# EAGLE design CharlieplexNameTag (EAGLE 6.5.0)
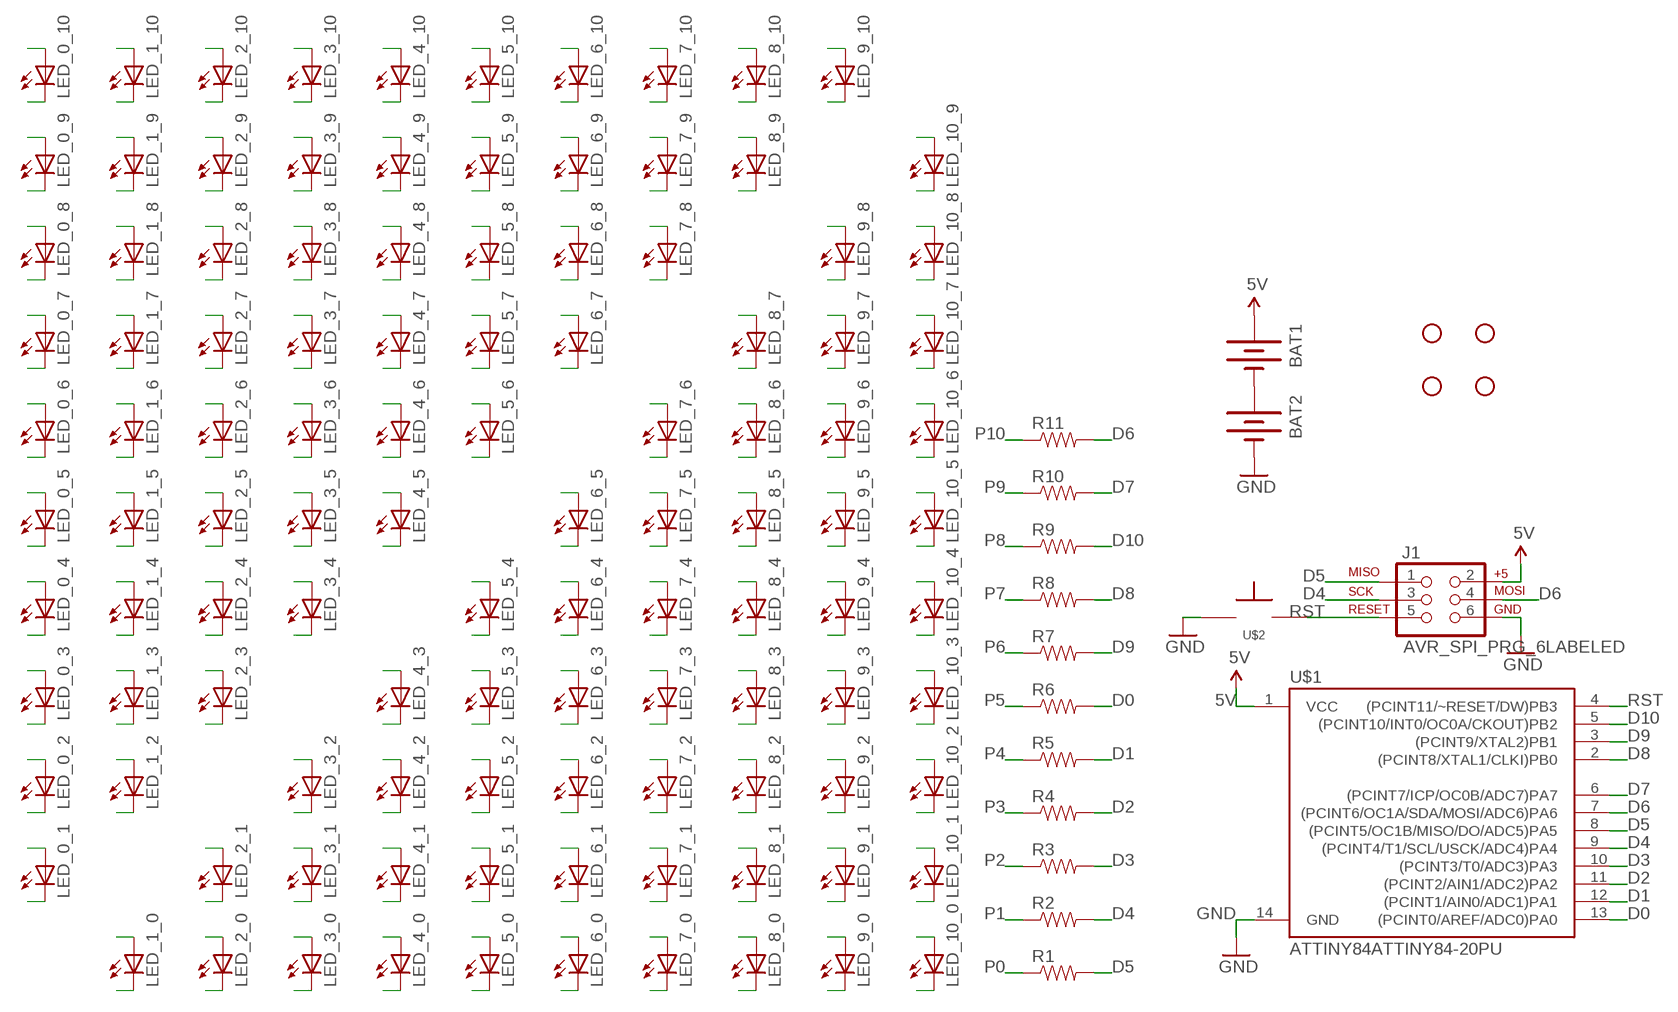
[diagram p0: schematic, sheet 1]

## Parts
BAT1  BATTERYAAA  [BATTERY-AAA]
BAT2  BATTERYAAA  [BATTERY-AAA]
J1  AVR_SPI_PRG_6LABELED  [2X3-NS]
LED_0_1  LED3MM  [LED3MM]
LED_0_2  LED3MM  [LED3MM]
LED_0_3  LED3MM  [LED3MM]
LED_0_4  LED3MM  [LED3MM]
LED_0_5  LED3MM  [LED3MM]
LED_0_6  LED3MM  [LED3MM]
LED_0_7  LED3MM  [LED3MM]
LED_0_8  LED3MM  [LED3MM]
LED_0_9  LED3MM  [LED3MM]
LED_0_10  LED3MM  [LED3MM]
LED_1_0  LED3MM  [LED3MM]
LED_1_2  LED3MM  [LED3MM]
LED_1_3  LED3MM  [LED3MM]
LED_1_4  LED3MM  [LED3MM]
LED_1_5  LED3MM  [LED3MM]
LED_1_6  LED3MM  [LED3MM]
LED_1_7  LED3MM  [LED3MM]
LED_1_8  LED3MM  [LED3MM]
LED_1_9  LED3MM  [LED3MM]
LED_1_10  LED3MM  [LED3MM]
LED_2_0  LED3MM  [LED3MM]
LED_2_1  LED3MM  [LED3MM]
LED_2_3  LED3MM  [LED3MM]
LED_2_4  LED3MM  [LED3MM]
LED_2_5  LED3MM  [LED3MM]
LED_2_6  LED3MM  [LED3MM]
LED_2_7  LED3MM  [LED3MM]
LED_2_8  LED3MM  [LED3MM]
LED_2_9  LED3MM  [LED3MM]
LED_2_10  LED3MM  [LED3MM]
LED_3_0  LED3MM  [LED3MM]
LED_3_1  LED3MM  [LED3MM]
LED_3_2  LED3MM  [LED3MM]
LED_3_4  LED3MM  [LED3MM]
LED_3_5  LED3MM  [LED3MM]
LED_3_6  LED3MM  [LED3MM]
LED_3_7  LED3MM  [LED3MM]
LED_3_8  LED3MM  [LED3MM]
LED_3_9  LED3MM  [LED3MM]
LED_3_10  LED3MM  [LED3MM]
LED_4_0  LED3MM  [LED3MM]
LED_4_1  LED3MM  [LED3MM]
LED_4_2  LED3MM  [LED3MM]
LED_4_3  LED3MM  [LED3MM]
LED_4_5  LED3MM  [LED3MM]
LED_4_6  LED3MM  [LED3MM]
LED_4_7  LED3MM  [LED3MM]
LED_4_8  LED3MM  [LED3MM]
LED_4_9  LED3MM  [LED3MM]
LED_4_10  LED3MM  [LED3MM]
LED_5_0  LED3MM  [LED3MM]
LED_5_1  LED3MM  [LED3MM]
LED_5_2  LED3MM  [LED3MM]
LED_5_3  LED3MM  [LED3MM]
LED_5_4  LED3MM  [LED3MM]
LED_5_6  LED3MM  [LED3MM]
LED_5_7  LED3MM  [LED3MM]
LED_5_8  LED3MM  [LED3MM]
LED_5_9  LED3MM  [LED3MM]
LED_5_10  LED3MM  [LED3MM]
LED_6_0  LED3MM  [LED3MM]
LED_6_1  LED3MM  [LED3MM]
LED_6_2  LED3MM  [LED3MM]
LED_6_3  LED3MM  [LED3MM]
LED_6_4  LED3MM  [LED3MM]
LED_6_5  LED3MM  [LED3MM]
LED_6_7  LED3MM  [LED3MM]
LED_6_8  LED3MM  [LED3MM]
LED_6_9  LED3MM  [LED3MM]
LED_6_10  LED3MM  [LED3MM]
LED_7_0  LED3MM  [LED3MM]
LED_7_1  LED3MM  [LED3MM]
LED_7_2  LED3MM  [LED3MM]
LED_7_3  LED3MM  [LED3MM]
LED_7_4  LED3MM  [LED3MM]
LED_7_5  LED3MM  [LED3MM]
LED_7_6  LED3MM  [LED3MM]
LED_7_8  LED3MM  [LED3MM]
LED_7_9  LED3MM  [LED3MM]
LED_7_10  LED3MM  [LED3MM]
LED_8_0  LED3MM  [LED3MM]
LED_8_1  LED3MM  [LED3MM]
LED_8_2  LED3MM  [LED3MM]
LED_8_3  LED3MM  [LED3MM]
LED_8_4  LED3MM  [LED3MM]
LED_8_5  LED3MM  [LED3MM]
LED_8_6  LED3MM  [LED3MM]
LED_8_7  LED3MM  [LED3MM]
LED_8_9  LED3MM  [LED3MM]
LED_8_10  LED3MM  [LED3MM]
LED_9_0  LED3MM  [LED3MM]
LED_9_1  LED3MM  [LED3MM]
LED_9_2  LED3MM  [LED3MM]
LED_9_3  LED3MM  [LED3MM]
LED_9_4  LED3MM  [LED3MM]
LED_9_5  LED3MM  [LED3MM]
LED_9_6  LED3MM  [LED3MM]
LED_9_7  LED3MM  [LED3MM]
LED_9_8  LED3MM  [LED3MM]
LED_9_10  LED3MM  [LED3MM]
LED_10_0  LED3MM  [LED3MM]
LED_10_1  LED3MM  [LED3MM]
LED_10_2  LED3MM  [LED3MM]
LED_10_3  LED3MM  [LED3MM]
LED_10_4  LED3MM  [LED3MM]
LED_10_5  LED3MM  [LED3MM]
LED_10_6  LED3MM  [LED3MM]
LED_10_7  LED3MM  [LED3MM]
LED_10_8  LED3MM  [LED3MM]
LED_10_9  LED3MM  [LED3MM]
R1  RESISTORAXIAL-0.3  [AXIAL-0.3]
R2  RESISTORAXIAL-0.3  [AXIAL-0.3]
R3  RESISTORAXIAL-0.3  [AXIAL-0.3]
R4  RESISTORAXIAL-0.3  [AXIAL-0.3]
R5  RESISTORAXIAL-0.3  [AXIAL-0.3]
R6  RESISTORAXIAL-0.3  [AXIAL-0.3]
R7  RESISTORAXIAL-0.3  [AXIAL-0.3]
R8  RESISTORAXIAL-0.3  [AXIAL-0.3]
R9  RESISTORAXIAL-0.3  [AXIAL-0.3]
R10  RESISTORAXIAL-0.3  [AXIAL-0.3]
R11  RESISTORAXIAL-0.3  [AXIAL-0.3]
STANDOFF1  STAND-OFF  [STAND-OFF]
STANDOFF2  STAND-OFF  [STAND-OFF]
STANDOFF3  STAND-OFF  [STAND-OFF]
STANDOFF4  STAND-OFF  [STAND-OFF]
U$1  ATTINY84ATTINY84-20PU  [DIL14]
U$2  TAC_SPST_NO  [TAC_SPST_NO]

## Nets
5V: BAT1.PWR@1(+) J1.2 U$1.1(VCC)
D0: R6.P$2 U$1.13((PCINT0/AREF/ADC0)PA0)
D1: R5.P$2 U$1.12((PCINT1/AIN0/ADC1)PA1)
D2: R4.P$2 U$1.11((PCINT2/AIN1/ADC2)PA2)
D3: R3.P$2 U$1.10((PCINT3/T0/ADC3)PA3)
D4: J1.3 R2.P$2 U$1.9((PCINT4/T1/SCL/USCK/ADC4)PA4)
D5: J1.1 R1.P$2 U$1.8((PCINT5/OC1B/MISO/DO/ADC5)PA5)
D6: J1.4 R11.P$2 U$1.7((PCINT6/OC1A/SDA/MOSI/ADC6)PA6)
D7: R10.P$2 U$1.6((PCINT7/ICP/OC0B/ADC7)PA7)
D8: R8.P$2 U$1.2((PCINT8/XTAL1/CLKI)PB0)
D9: R7.P$2 U$1.3((PCINT9/XTAL2)PB1)
D10: R9.P$2 U$1.5((PCINT10/INT0/OC0A/CKOUT)PB2)
GND: BAT2.GND@1(-) J1.6 U$1.14(GND) U$2.P$1
N$2: BAT1.GND@1(-) BAT2.PWR@1(+)
P0: LED_0_1.K(C) LED_0_2.K(C) LED_0_3.K(C) LED_0_4.K(C) LED_0_5.K(C) LED_0_6.K(C) LED_0_7.K(C) LED_0_8.K(C) LED_0_9.K(C) LED_0_10.K(C) LED_1_0.A LED_2_0.A LED_3_0.A LED_4_0.A LED_5_0.A LED_6_0.A LED_7_0.A LED_8_0.A LED_9_0.A LED_10_0.A R1.P$1
P1: LED_0_1.A LED_1_0.K(C) LED_1_2.K(C) LED_1_3.K(C) LED_1_4.K(C) LED_1_5.K(C) LED_1_6.K(C) LED_1_7.K(C) LED_1_8.K(C) LED_1_9.K(C) LED_1_10.K(C) LED_2_1.A LED_3_1.A LED_4_1.A LED_5_1.A LED_6_1.A LED_7_1.A LED_8_1.A LED_9_1.A LED_10_1.A R2.P$1
P2: LED_0_2.A LED_1_2.A LED_2_0.K(C) LED_2_1.K(C) LED_2_3.K(C) LED_2_4.K(C) LED_2_5.K(C) LED_2_6.K(C) LED_2_7.K(C) LED_2_8.K(C) LED_2_9.K(C) LED_2_10.K(C) LED_3_2.A LED_4_2.A LED_5_2.A LED_6_2.A LED_7_2.A LED_8_2.A LED_9_2.A LED_10_2.A R3.P$1
P3: LED_0_3.A LED_1_3.A LED_2_3.A LED_3_0.K(C) LED_3_1.K(C) LED_3_2.K(C) LED_3_4.K(C) LED_3_5.K(C) LED_3_6.K(C) LED_3_7.K(C) LED_3_8.K(C) LED_3_9.K(C) LED_3_10.K(C) LED_4_3.A LED_5_3.A LED_6_3.A LED_7_3.A LED_8_3.A LED_9_3.A LED_10_3.A R4.P$1
P4: LED_0_4.A LED_1_4.A LED_2_4.A LED_3_4.A LED_4_0.K(C) LED_4_1.K(C) LED_4_2.K(C) LED_4_3.K(C) LED_4_5.K(C) LED_4_6.K(C) LED_4_7.K(C) LED_4_8.K(C) LED_4_9.K(C) LED_4_10.K(C) LED_5_4.A LED_6_4.A LED_7_4.A LED_8_4.A LED_9_4.A LED_10_4.A R5.P$1
P5: LED_0_5.A LED_1_5.A LED_2_5.A LED_3_5.A LED_4_5.A LED_5_0.K(C) LED_5_1.K(C) LED_5_2.K(C) LED_5_3.K(C) LED_5_4.K(C) LED_5_6.K(C) LED_5_7.K(C) LED_5_8.K(C) LED_5_9.K(C) LED_5_10.K(C) LED_6_5.A LED_7_5.A LED_8_5.A LED_9_5.A LED_10_5.A R6.P$1
P6: LED_0_6.A LED_1_6.A LED_2_6.A LED_3_6.A LED_4_6.A LED_5_6.A LED_6_0.K(C) LED_6_1.K(C) LED_6_2.K(C) LED_6_3.K(C) LED_6_4.K(C) LED_6_5.K(C) LED_6_7.K(C) LED_6_8.K(C) LED_6_9.K(C) LED_6_10.K(C) LED_7_6.A LED_8_6.A LED_9_6.A LED_10_6.A R7.P$1
P7: LED_0_7.A LED_1_7.A LED_2_7.A LED_3_7.A LED_4_7.A LED_5_7.A LED_6_7.A LED_7_0.K(C) LED_7_1.K(C) LED_7_2.K(C) LED_7_3.K(C) LED_7_4.K(C) LED_7_5.K(C) LED_7_6.K(C) LED_7_8.K(C) LED_7_9.K(C) LED_7_10.K(C) LED_8_7.A LED_9_7.A LED_10_7.A R8.P$1
P8: LED_0_8.A LED_1_8.A LED_2_8.A LED_3_8.A LED_4_8.A LED_5_8.A LED_6_8.A LED_7_8.A LED_8_0.K(C) LED_8_1.K(C) LED_8_2.K(C) LED_8_3.K(C) LED_8_4.K(C) LED_8_5.K(C) LED_8_6.K(C) LED_8_7.K(C) LED_8_9.K(C) LED_8_10.K(C) LED_9_8.A LED_10_8.A R9.P$1
P9: LED_0_9.A LED_1_9.A LED_2_9.A LED_3_9.A LED_4_9.A LED_5_9.A LED_6_9.A LED_7_9.A LED_8_9.A LED_9_0.K(C) LED_9_1.K(C) LED_9_2.K(C) LED_9_3.K(C) LED_9_4.K(C) LED_9_5.K(C) LED_9_6.K(C) LED_9_7.K(C) LED_9_8.K(C) LED_9_10.K(C) LED_10_9.A R10.P$1
P10: LED_0_10.A LED_1_10.A LED_2_10.A LED_3_10.A LED_4_10.A LED_5_10.A LED_6_10.A LED_7_10.A LED_8_10.A LED_9_10.A LED_10_0.K(C) LED_10_1.K(C) LED_10_2.K(C) LED_10_3.K(C) LED_10_4.K(C) LED_10_5.K(C) LED_10_6.K(C) LED_10_7.K(C) LED_10_8.K(C) LED_10_9.K(C) R11.P$1
RST: J1.5 U$1.4((PCINT11/~RESET/DW)PB3) U$2.P$2

## Library data of the parts
BAT1 BAT2 = SparkFun-Electromechanical:BATTERY: Battery Holders Various common sizes : AA, AAA, 20mm coin cell and 12mm coin cell. 20MM_4LEGS, BATT-10373; PROD_ID: BATT-08571
J1 = barbary_enterprises:AVR_SPI_PRG_6: AVR ISP 6 Pin This is the reduced ISP connector for AVR programming. Common on Arduino. This footprint will take up less PCB space and can be used with a 10-pin to 6-pin adapter such as SKU: BOB-08508
LED_0_1-LED_0_10 LED_1_0 LED_1_2-LED_1_10 LED_2_0 LED_2_1 LED_2_3-LED_2_10 LED_3_0 LED_3_1 LED_3_2 LED_3_4-LED_3_10 LED_4_0 LED_4_1-LED_4_3 LED_4_5-LED_4_10 LED_5_0 LED_5_1-LED_5_4 LED_5_6-LED_5_10 LED_6_0 LED_6_1-LED_6_5 LED_6_7-LED_6_10 LED_7_0 LED_7_1-LED_7_6 LED_7_8-LED_7_10 LED_8_0 LED_8_1-LED_8_7 LED_8_9 LED_8_10 LED_9_0 LED_9_1-LED_9_8 LED_9_10 LED_10_0 LED_10_1-LED_10_9 = barbary_enterprises:LED: LEDs Standard schematic elements and footprints for 5mm, 3mm, 1206, and 0603 sized LEDs. 5mm - Spark Fun Electronics SKU : COM-00529 (and others)
R1-R11 = barbary_enterprises:RESISTOR: Resistor Basic schematic elements and footprints for 0603, 1206, and PTH resistors.
STANDOFF1-STANDOFF4 = SparkFun-Electromechanical:STAND-OFF: #4 Stand Off This is the mechanical footprint for a #4 phillips button head screw. Use the keepout ring to avoid running the screw head into surrounding components. SKU : PRT-00447
U$1 = SparkFun-DigitalIC:ATTINY84: Atmel 14-pin 2/4/8kB flash uC
U$2 = barbary_enterprises:TAC_SPST_NO: 3,5 mm Tact Switches C&K PTS635 Series * Digi-Key Part Number: CKN9102-ND

## Board
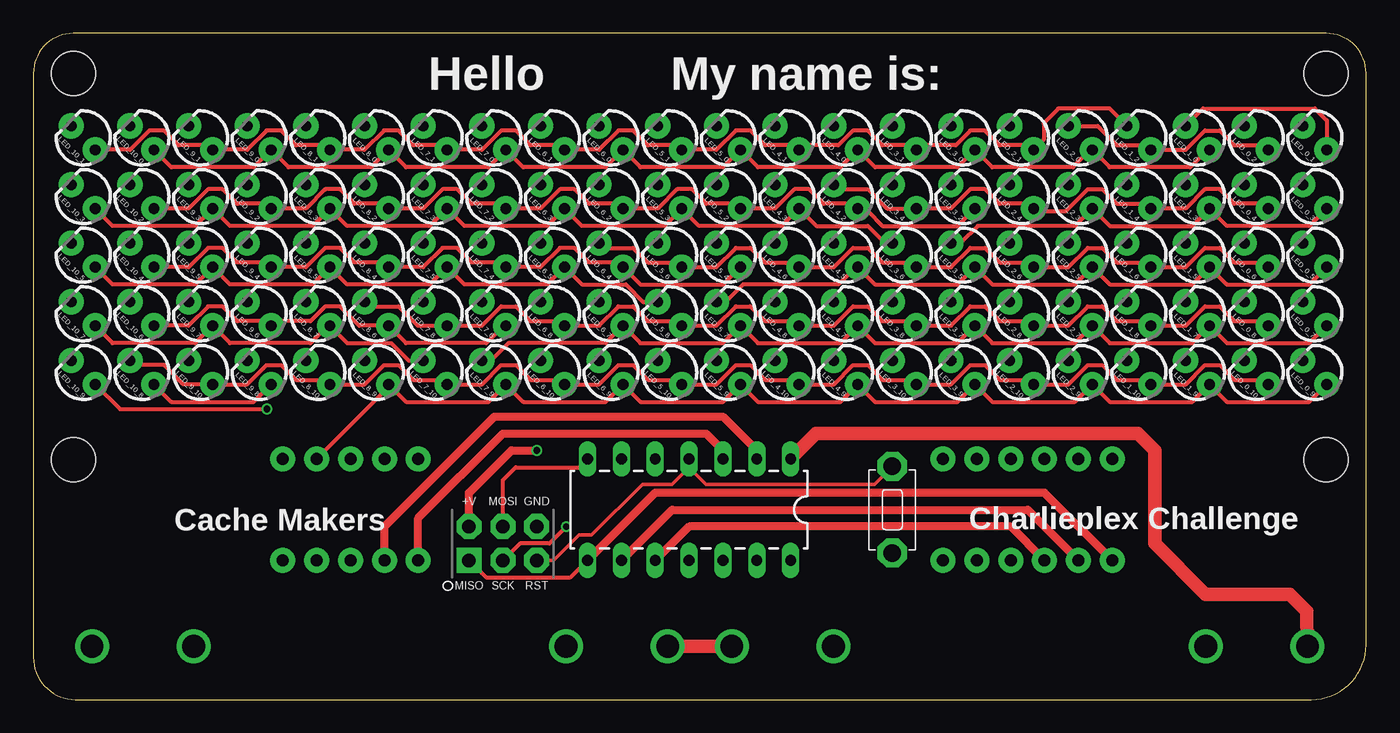
[diagram p1: board, top side]
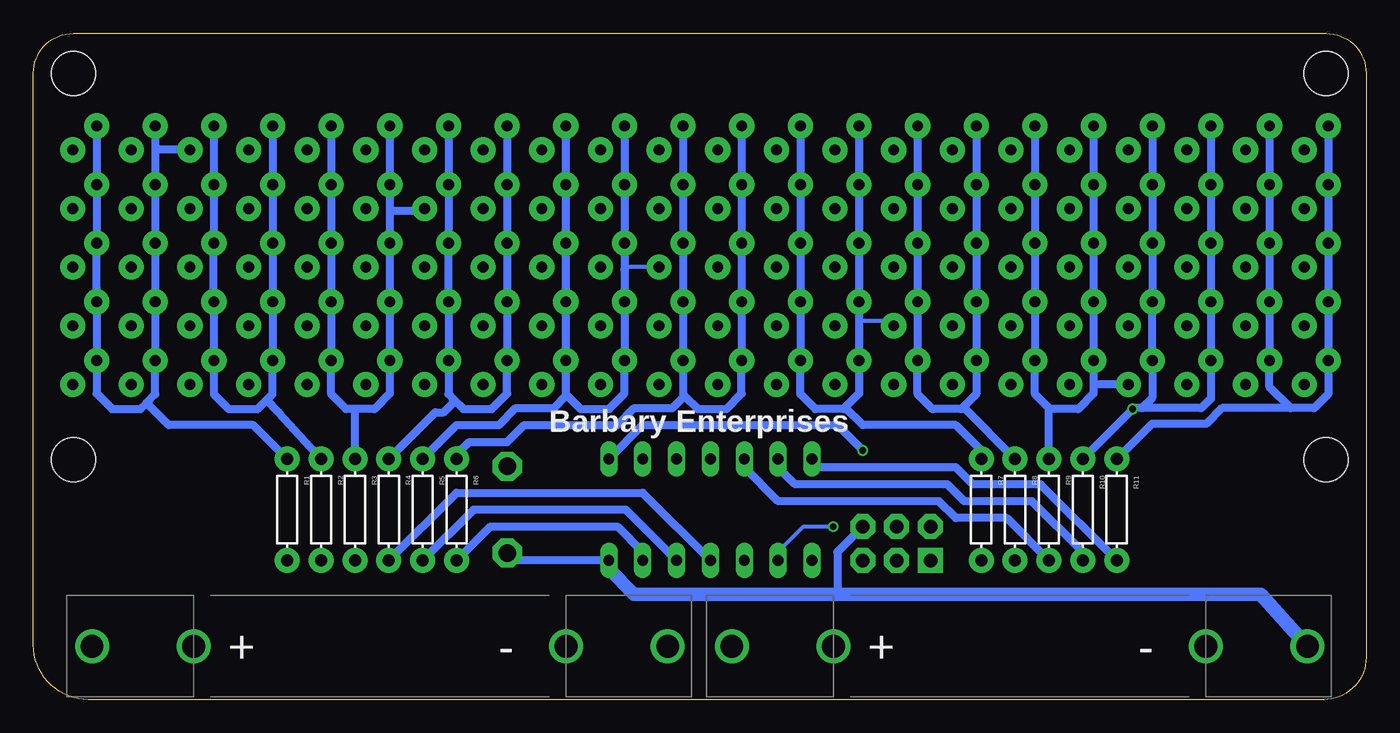
[diagram p2: board, bottom side, seen from below]

Size 100 x 50 mm. Coordinates in mm from the lower left corner, seen from the top.
Outline: 100,4.12 100,47 arc90 97,50 3,50 arc90 0,47 0,3.16 arc90 3.16,0 95.88,0 arc90 100,4.12
Copper layers (1*16): Top 0.035mm / dielectric 1.5mm / Bottom 0.035mm
Design rules "ITEADstudio_DRC": minimum track width 6mil, minimum drill 12mil, track to track 6mil, track to pad 6mil, pad to pad 6mil, via to via 6mil, smd to smd 0mil, copper to edge 10mil, drill to drill 10mil, minimum pad ring 10mil, minimum via ring 6mil, stop-mask expansion 2mil, vias tented up to drill 100mil, thermal gap 10mil

### Footprints (pad centres in the part's own frame; a part is rotated, then mirrored left to right if it is on the bottom)
BATTERY-AAA = drill 1.702: GND@1 21.59,0; GND@2 13.97,0; PWR@1 -21.59,0; PWR@2 -13.97,0
2X3-NS = drill 1.016 pad 1.88 square: 1 -2.54,-1.27 | drill 1.016 pad 1.88 octagon: 2 -2.54,1.27; 3 0,-1.27; 4 0,1.27; 5 2.54,-1.27; 6 2.54,1.27
LED3MM = drill 0.813 pad 1.88: A -1.27,0; K 1.27,0
AXIAL-0.3 = drill 0.9 pad 1.88: P$1 -3.81,0; P$2 3.81,0
STAND-OFF = hole 3.302: 0,0
DIL14 = drill 0.813 long: 1 -8.89,-3.81; 2 -6.35,-3.81; 3 -3.81,-3.81; 4 -1.27,-3.81; 5 1.27,-3.81; 6 3.81,-3.81; 7 6.35,-3.81; 8 6.35,3.81; 9 3.81,3.81; 10 1.27,3.81; 11 -1.27,3.81; 12 -3.81,3.81; 13 -6.35,3.81; 14 -8.89,3.81
TAC_SPST_NO = drill 1.3 pad 2.184 octagon: P$1 -3.251,0; P$2 3.251,0

### Placement (x,y rotation side)
BAT1  74,4 0 bottom
BAT2  26,4 0 bottom
J1  35.23,11.71 0 top
LED_0_1  96.15,42.15 135 top
LED_0_2  91.75,42.15 135 top
LED_0_3  96.15,37.75 135 top
LED_0_4  91.75,37.75 135 top
LED_0_5  96.15,33.35 135 top
LED_0_6  91.75,33.35 135 top
LED_0_7  96.15,28.95 135 top
LED_0_8  91.75,28.95 135 top
LED_0_9  96.15,24.55 135 top
LED_0_10  91.75,24.55 135 top
LED_1_0  87.35,42.15 135 top
LED_1_2  82.95,42.15 135 top
LED_1_3  87.35,37.75 135 top
LED_1_4  82.95,37.75 135 top
LED_1_5  87.35,33.35 135 top
LED_1_6  82.95,33.35 135 top
LED_1_7  87.35,28.95 135 top
LED_1_8  82.95,28.95 135 top
LED_1_9  87.35,24.55 135 top
LED_1_10  82.95,24.55 135 top
LED_2_0  78.55,42.15 135 top
LED_2_1  74.15,42.15 135 top
LED_2_3  78.55,37.75 135 top
LED_2_4  74.15,37.75 135 top
LED_2_5  78.55,33.35 135 top
LED_2_6  74.15,33.35 135 top
LED_2_7  78.55,28.95 135 top
LED_2_8  74.15,28.95 135 top
LED_2_9  78.55,24.55 135 top
LED_2_10  74.15,24.55 135 top
LED_3_0  69.75,42.15 135 top
LED_3_1  65.35,42.15 135 top
LED_3_2  69.75,37.75 135 top
LED_3_4  65.35,37.75 135 top
LED_3_5  69.75,33.35 135 top
LED_3_6  65.35,33.35 135 top
LED_3_7  69.75,28.95 135 top
LED_3_8  65.35,28.95 135 top
LED_3_9  69.75,24.55 135 top
LED_3_10  65.35,24.55 135 top
LED_4_0  60.95,42.15 135 top
LED_4_1  56.55,42.15 135 top
LED_4_2  60.95,37.75 135 top
LED_4_3  56.55,37.75 135 top
LED_4_5  60.95,33.35 135 top
LED_4_6  56.55,33.35 135 top
LED_4_7  60.95,28.95 135 top
LED_4_8  56.55,28.95 135 top
LED_4_9  60.95,24.55 135 top
LED_4_10  56.55,24.55 135 top
LED_5_0  52.15,42.15 135 top
LED_5_1  47.75,42.15 135 top
LED_5_2  52.15,37.75 135 top
LED_5_3  47.75,37.75 135 top
LED_5_4  52.15,33.35 135 top
LED_5_6  47.75,33.35 135 top
LED_5_7  52.15,28.95 135 top
LED_5_8  47.75,28.95 135 top
LED_5_9  52.15,24.55 135 top
LED_5_10  47.75,24.55 135 top
LED_6_0  43.35,42.15 135 top
LED_6_1  38.95,42.15 135 top
LED_6_2  43.35,37.75 135 top
LED_6_3  38.95,37.75 135 top
LED_6_4  43.35,33.35 135 top
LED_6_5  38.95,33.35 135 top
LED_6_7  43.35,28.95 135 top
LED_6_8  38.95,28.95 135 top
LED_6_9  43.35,24.55 135 top
LED_6_10  38.95,24.55 135 top
LED_7_0  34.55,42.15 135 top
LED_7_1  30.15,42.15 135 top
LED_7_2  34.55,37.75 135 top
LED_7_3  30.15,37.75 135 top
LED_7_4  34.55,33.35 135 top
LED_7_5  30.15,33.35 135 top
LED_7_6  34.55,28.95 135 top
LED_7_8  30.15,28.95 135 top
LED_7_9  34.55,24.55 135 top
LED_7_10  30.15,24.55 135 top
LED_8_0  25.75,42.15 135 top
LED_8_1  21.35,42.15 135 top
LED_8_2  25.75,37.75 135 top
LED_8_3  21.35,37.75 135 top
LED_8_4  25.75,33.35 135 top
LED_8_5  21.35,33.35 135 top
LED_8_6  25.75,28.95 135 top
LED_8_7  21.35,28.95 135 top
LED_8_9  25.75,24.55 135 top
LED_8_10  21.35,24.55 135 top
LED_9_0  16.95,42.15 135 top
LED_9_1  12.55,42.15 135 top
LED_9_2  16.95,37.75 135 top
LED_9_3  12.55,37.75 135 top
LED_9_4  16.95,33.35 135 top
LED_9_5  12.55,33.35 135 top
LED_9_6  16.95,28.95 135 top
LED_9_7  12.55,28.95 135 top
LED_9_8  16.95,24.55 135 top
LED_9_10  12.55,24.55 135 top
LED_10_0  8.15,42.15 135 top
LED_10_1  3.75,42.15 135 top
LED_10_2  8.15,37.75 135 top
LED_10_3  3.75,37.75 135 top
LED_10_4  8.15,33.35 135 top
LED_10_5  3.75,33.35 135 top
LED_10_6  8.15,28.95 135 top
LED_10_7  3.75,28.95 135 top
LED_10_8  8.15,24.55 135 top
LED_10_9  3.75,24.55 135 top
R1  80.95,14.25 270 bottom
R2  78.41,14.25 270 bottom
R3  75.87,14.25 270 bottom
R4  73.33,14.25 270 bottom
R5  70.79,14.25 270 bottom
R6  68.25,14.25 270 bottom
R7  28.88,14.25 270 bottom
R8  26.34,14.25 270 bottom
R9  23.8,14.25 270 bottom
R10  21.26,14.25 270 bottom
R11  18.72,14.25 270 bottom
STANDOFF1  3,18 0 top
STANDOFF2  97,18 0 top
STANDOFF3  3,47 0 top
STANDOFF4  97,47 0 top
U$1  47.93,14.25 180 top
U$2  64.44,14.25 90 top

### Tracks (layer width: path | path; a pad name or v marks a point on that pad's centre or on a via)
5V  (via drill 0.51)
  Top 0.61: J1.2 32.69,15.52 35.87,18.7 v37.77,18.7
  Top 1.016: U$1.1 58.73,19.96 82.86,19.96 84.12,18.7 84.12,11.71 87.94,7.9 94.28,7.9 95.56,6.63 BAT1.PWR@1
  Bottom 0.61: U$1.1 54.28,20.6 39.67,20.6 v37.77,18.7
D0
  Bottom 0.61: R6.P$2 65.71,12.98 56.19,12.98 54.28,11.07 U$1.13
D1
  Bottom 0.61: U$1.12 55.55,14.25 66.98,14.25 R5.P$2
D2
  Bottom 0.61: R4.P$2 68.25,15.52 54.28,15.52 U$1.11
D3
  Top 0.61: R3.P$2 73.33,12.98 49.2,12.98 U$1.10
D4  (via drill 0.51)
  Top 0.305: v39.99,12.98 38.72,11.71 36.5,11.71 J1.3
  Top 0.61: U$1.9 47.93,14.25 74.6,14.25 R2.P$2
  Bottom 0.305: U$1.9 44.12,11.07 42.22,12.98 v39.99,12.98
D5
  Top 0.305: J1.1 33.96,9.17 40.31,9.17 U$1.8
  Top 0.61: R1.P$2 75.87,15.52 46.66,15.52 U$1.8
D6
  Top 0.305: J1.4 35.23,16.47 36.18,17.43 40.95,17.43 U$1.7
  Bottom 0.61: R11.P$2 24.43,16.16 29.52,16.16 30.79,17.43 41.58,17.43 U$1.7
D7
  Bottom 0.61: R10.P$2 21.26,11.07 25.07,14.88 30.15,14.88 31.42,16.16 42.85,16.16 44.12,17.43 U$1.6
D8
  Top 0.61: R8.P$2 26.34,12.98 34.59,21.23 51.74,21.23 54.28,18.7 U$1.2
D9
  Top 0.61: R7.P$2 28.88,13.62 35.23,19.96 50.47,19.96 51.74,18.7 U$1.3
D10
  Bottom 0.61: R9.P$2 26.98,13.62 30.79,13.62 32.05,14.88 44.12,14.88 46.66,17.43 U$1.5
GND
  Bottom 0.61: J1.6 39.67,11.07 39.67,7.9 | 56.82,9.8 U$1.14 63.88,10.44 U$2.P$1
  Bottom 1.016: BAT2.GND@1 7.92,7.9 39.67,7.9 54.91,7.9 56.82,9.8
N$2
  Top 1.016: BAT1.GND@1 BAT2.PWR@1
P0
  Top 0.305: LED_1_0.A 88.1,41.25 86.8,39.95 80.75,39.95 LED_2_0.A 79.3,41.25 78,39.95 71.95,39.95 LED_3_0.A 69.35,39.95 63.15,39.95 LED_4_0.A 60.55,39.95 54.35,39.95 LED_5_0.A 51.75,39.95 45.55,39.95 LED_6_0.A 42.95,39.95 36.75,39.95 LED_7_0.A 34.15,39.95 27.95,39.95 LED_8_0.A 25.35,39.95 19.15,39.95 LED_9_0.A 16.55,39.95 10.35,39.95 LED_10_0.A
  Bottom 0.61: LED_0_2.K 90.85,41.05 | 90.85,41.05 LED_0_4.K LED_0_6.K LED_0_8.K LED_0_10.K 90.85,22.92 91.5,22.27 | LED_0_1.K LED_0_3.K LED_0_5.K LED_0_7.K LED_0_9.K 95.25,22.95 94.1,21.8 91.97,21.8 91.5,22.27 | LED_1_0.A 90.65,41.25 90.85,41.05 | R1.P$1 83.49,20.6 89.84,20.6 91.5,22.27
P1
  Top 0.305: LED_1_2.K 80.75,44.35 76.9,44.35 75.8,43.25 75.8,42 LED_2_1.A 74.7,41.6 72.5,41.6 71.4,42.7 70.3,42.7 69.2,41.6 67,41.6 66.65,41.25 LED_3_1.A 65.9,41.6 63.7,41.6 62.6,42.7 61.5,42.7 60.4,41.6 58.2,41.6 57.85,41.25 LED_4_1.A 57.1,41.6 54.9,41.6 53.8,42.7 52.7,42.7 51.25,41.25 LED_5_1.A 48.3,41.6 46.1,41.6 45,42.7 43.9,42.7 42.45,41.25 LED_6_1.A 39.5,41.6 37.3,41.6 36.2,42.7 35.1,42.7 33.65,41.25 LED_7_1.A 30.7,41.6 28.5,41.6 27.4,42.7 26.3,42.7 24.85,41.25 LED_8_1.A 21.9,41.6 19.7,41.6 18.6,42.7 17.5,42.7 16.05,41.25 LED_9_1.A 13.1,41.6 10.9,41.6 9.8,42.7 8.7,42.7 7.25,41.25 LED_10_1.A | LED_1_0.K 87.75,44.35 96.15,44.35 97.05,43.45 LED_0_1.A
  Bottom 0.61: LED_1_2.K LED_1_4.K LED_1_6.K LED_1_8.K LED_1_10.K 82.05,22.92 82.5,22.47 | LED_1_0.K LED_1_3.K LED_1_5.K LED_1_7.K LED_1_9.K 86.45,22.92 85.33,21.8 83.17,21.8 82.5,22.47 | R2.P$1 81.58,21.55 82.5,22.47
P2
  Top 0.305: LED_2_0.K 79.85,43.05 81.3,41.6 83.5,41.6 LED_1_2.A 86.45,41.25 87.9,42.7 89,42.7 90.1,41.6 92.3,41.6 LED_0_2.A | LED_10_2.A 11.65,36.85 13.1,38.3 14.2,38.3 15.3,37.2 17.5,37.2 LED_9_2.A 20.45,36.85 21.9,38.3 23,38.3 24.1,37.2 26.3,37.2 LED_8_2.A 29.25,36.85 30.7,38.3 31.8,38.3 32.9,37.2 35.1,37.2 LED_7_2.A 38.05,36.85 39.5,38.3 40.6,38.3 41.7,37.2 43.9,37.2 LED_6_2.A 46.85,36.85 48.3,38.3 49.4,38.3 50.5,37.2 52.7,37.2 LED_5_2.A 55.65,36.85 57.1,38.3 58.2,38.3 59.3,37.2 61.5,37.2 LED_4_2.A 62.05,36.65 62.6,36.65 63.7,35.55 69.35,35.55 LED_3_2.A
  Bottom 0.61: LED_2_1.K LED_2_4.K 73.25,36.65 | 73.25,36.65 LED_2_6.K LED_2_8.K LED_2_10.K 73.25,22.95 74.41,21.8 75.87,21.8 | LED_2_0.K LED_2_3.K LED_2_5.K LED_2_7.K LED_2_9.K 77.65,22.92 76.53,21.8 75.87,21.8 | LED_3_2.A 70.85,36.65 73.25,36.65 | R3.P$1 75.87,21.8
P3
  Top 0.305: LED_3_6.K 63.7,34.45 62.6,35.55 58.75,35.55 LED_4_3.A 56.15,35.55 49.95,35.55 LED_5_3.A 47.35,35.55 41.15,35.55 LED_6_3.A 38.55,35.55 32.35,35.55 LED_7_3.A 29.75,35.55 23.55,35.55 LED_8_3.A 20.95,35.55 14.75,35.55 LED_9_3.A 12.15,35.55 5.95,35.55 LED_10_3.A | LED_3_5.K 69.55,34.25 70.85,35.55 78.15,35.55 LED_2_3.A 80.75,35.55 86.95,35.55 LED_1_3.A 89.55,35.55 95.75,35.55 LED_0_3.A
  Bottom 0.61: LED_3_1.K LED_3_4.K LED_3_6.K LED_3_8.K LED_3_10.K 64.45,22.95 65.61,21.8 67.73,21.8 68.5,22.57 | LED_3_0.K LED_3_2.K LED_3_5.K LED_3_7.K LED_3_9.K 68.85,22.92 68.5,22.57 | R4.P$1 69.84,21.55 69.2,21.55 68.5,22.25 68.5,22.57
P4
  Top 0.305: LED_4_2.K 60.4,38.3 62.6,38.3 64.05,36.85 LED_3_4.A 68.85,36.85 70.3,38.3 71.4,38.3 72.5,37.2 74.7,37.2 LED_2_4.A 75.25,36.65 77.45,36.65 79.1,38.3 80.2,38.3 81.3,37.2 83.5,37.2 LED_1_4.A 86.45,36.85 87.9,38.3 89,38.3 90.1,37.2 92.3,37.2 LED_0_4.A | LED_5_4.A 51.75,31.15 45.55,31.15 LED_6_4.A 43.9,32.8 41.7,32.8 40.6,33.9 39.5,33.9 38.05,32.45 LED_7_4.A 35.1,32.8 32.9,32.8 31.8,33.9 30.7,33.9 29.25,32.45 LED_8_4.A 26.3,32.8 24.1,32.8 23,33.9 21.9,33.9 20.45,32.45 LED_9_4.A 17.5,32.8 15.3,32.8 14.2,33.9 13.1,33.9 11.65,32.45 LED_10_4.A
  Bottom 0.305: LED_5_4.A 55.45,32.45 55.65,32.25
  Bottom 0.61: LED_4_1.K LED_4_3.K LED_4_6.K 55.65,32.25 LED_4_8.K LED_4_10.K 55.65,22.95 56.81,21.8 58.93,21.8 59.98,22.84 | LED_4_0.K LED_4_2.K LED_4_5.K LED_4_7.K LED_4_9.K 60.05,22.92 59.98,22.84 | R5.P$1 68.25,20.6 65.08,20.6 63.8,21.87 60.95,21.87 59.98,22.84
P5
  Top 0.305: LED_5_8.K 45.75,29.85 44.45,31.15 41.15,31.15 LED_6_5.A 38.55,31.15 32.35,31.15 LED_7_5.A 29.75,31.15 23.55,31.15 LED_8_5.A 20.95,31.15 14.75,31.15 LED_9_5.A 12.15,31.15 5.95,31.15 LED_10_5.A | LED_5_7.K 52.15,30.05 53.25,31.15 60.4,31.15 61.7,32.45 LED_4_5.A 63.15,31.15 69.35,31.15 LED_3_5.A 71.95,31.15 78.15,31.15 LED_2_5.A 80.75,31.15 86.95,31.15 LED_1_5.A 89.55,31.15 95.75,31.15 LED_0_5.A
  Bottom 0.61: LED_5_1.K LED_5_3.K LED_5_6.K LED_5_8.K LED_5_10.K 46.85,22.95 48.01,21.8 50.13,21.8 51.13,22.8 | LED_5_0.K LED_5_2.K LED_5_4.K LED_5_7.K LED_5_9.K 51.25,22.92 51.13,22.8 | R6.P$1 68.25,18.38 67.3,19.33 64.44,19.33 63.17,20.6 56.19,20.6 54.91,21.87 52.06,21.87 51.13,22.8
P6
  Top 0.305: LED_6_4.K 42.8,33.9 45,33.9 46.1,32.8 48.3,32.8 LED_5_6.A 51.25,32.45 52.7,33.9 53.8,33.9 54.9,32.8 57.1,32.8 LED_4_6.A 60.05,32.45 61.5,33.9 62.6,33.9 63.7,32.8 65.9,32.8 LED_3_6.A 68.85,32.45 70.3,33.9 71.4,33.9 72.5,32.8 74.7,32.8 LED_2_6.A 77.65,32.45 79.1,33.9 80.2,33.9 81.3,32.8 83.5,32.8 LED_1_6.A 86.45,32.45 87.9,33.9 89,33.9 90.1,32.8 92.3,32.8 LED_0_6.A | LED_7_6.A 35.3,28.05 34,26.75 27.95,26.75 LED_8_6.A 24.45,28.05 23,29.5 21.9,29.5 20.8,28.4 18.2,28.4 LED_9_6.A 17.5,28.4 15.3,28.4 14.2,29.5 13.1,29.5 11.65,28.05 LED_10_6.A
  Bottom 0.305: LED_7_6.A 35.8,28.4 38.05,28.4
  Bottom 0.61: LED_6_1.K LED_6_3.K LED_6_5.K LED_6_8.K 38.05,28.4 LED_6_10.K 38.05,22.95 39.09,21.92 | LED_6_0.K LED_6_2.K LED_6_4.K LED_6_7.K LED_6_9.K 42.45,22.92 41.33,21.8 39.21,21.8 39.09,21.92 | R7.P$1 28.88,18.7 30.79,20.6 37.77,20.6 39.09,21.92
P7
  Top 0.305: LED_7_10.K 28.15,25.45 26.85,26.75 23.55,26.75 LED_8_7.A 22.1,28.05 20.8,26.75 14.75,26.75 LED_9_7.A 12.15,26.75 5.95,26.75 LED_10_7.A | LED_7_9.K 34.35,25.45 35.65,26.75 42.95,26.75 LED_6_7.A 45.55,26.75 51.75,26.75 LED_5_7.A 54.35,26.75 60.55,26.75 LED_4_7.A 63.15,26.75 69.35,26.75 LED_3_7.A 71.95,26.75 78.15,26.75 LED_2_7.A 80.75,26.75 86.95,26.75 LED_1_7.A 89.55,26.75 95.75,26.75 LED_0_7.A
  Bottom 0.61: LED_7_1.K LED_7_3.K LED_7_5.K LED_7_8.K LED_7_10.K 29.25,22.92 30.23,21.95 | LED_7_0.K LED_7_2.K LED_7_4.K LED_7_6.K LED_7_9.K 33.65,22.92 32.53,21.8 30.37,21.8 30.23,21.95 | R8.P$1 30.23,21.95
P8
  Top 0.305: LED_8_6.K 25.2,29.5 27.4,29.5 28.85,28.05 LED_7_8.A 33.65,28.05 35.1,29.5 36.2,29.5 37.3,28.4 39.5,28.4 LED_6_8.A 42.45,28.05 43.9,29.5 45,29.5 46.1,28.4 48.3,28.4 LED_5_8.A 51.25,28.05 52.7,29.5 53.8,29.5 54.9,28.4 57.1,28.4 LED_4_8.A 60.05,28.05 61.5,29.5 62.6,29.5 63.7,28.4 65.9,28.4 LED_3_8.A 68.85,28.05 70.3,29.5 71.4,29.5 72.5,28.4 74.7,28.4 LED_2_8.A 77.65,28.05 79.1,29.5 80.2,29.5 81.3,28.4 83.5,28.4 LED_1_8.A 86.45,28.05 87.9,29.5 89,29.5 90.1,28.4 92.3,28.4 LED_0_8.A | LED_10_8.A 10.35,22.35 16.55,22.35 LED_9_8.A
  Bottom 0.61: LED_8_1.K LED_8_3.K LED_8_5.K LED_8_7.K LED_8_10.K 20.45,23.77 | LED_8_0.K LED_8_2.K LED_8_4.K LED_8_6.K LED_8_9.K 24.85,22.92 23.73,21.8 | 20.45,23.77 20.45,22.95 21.61,21.8 23.73,21.8 | LED_9_8.A 20.33,23.65 20.45,23.77 | R9.P$1 23.8,21.73 23.73,21.8
P9  (via drill 0.51)
  Top 0.305: LED_10_9.A 6.5,21.8 v17.52,21.8 | LED_0_9.A 95.75,22.35 89.55,22.35 LED_1_9.A 86.95,22.35 80.75,22.35 LED_2_9.A 78.15,22.35 71.95,22.35 LED_3_9.A 69.35,22.35 63.15,22.35 LED_4_9.A 60.55,22.35 54.35,22.35 LED_5_9.A 51.75,22.35 45.55,22.35 LED_6_9.A 42.95,22.35 36.75,22.35 LED_7_9.A 34.15,22.35 27.95,22.35 LED_8_9.A 26.65,23.45 R10.P$1
  Bottom 0.61: LED_9_1.K LED_9_3.K LED_9_5.K LED_9_7.K LED_9_10.K 11.65,22.59 12.37,21.87 16.82,21.87 | LED_9_0.K LED_9_2.K LED_9_4.K LED_9_6.K LED_9_8.K 16.05,22.63 16.82,21.87 | 16.82,21.87 17.45,21.87 v17.52,21.8 R10.P$1
P10
  Top 0.305: LED_10_8.K 7.6,25.1 9.8,25.1 11.25,23.65 LED_9_10.A 16.05,23.65 17.5,25.1 18.6,25.1 19.7,24 21.9,24 LED_8_10.A 24.85,23.65 26.3,25.1 27.4,25.1 28.5,24 30.7,24 LED_7_10.A 33.65,23.65 35.1,25.1 36.2,25.1 37.3,24 39.5,24 LED_6_10.A 42.45,23.65 43.9,25.1 45,25.1 46.1,24 48.3,24 LED_5_10.A 51.25,23.65 52.7,25.1 53.8,25.1 54.9,24 57.1,24 LED_4_10.A 60.05,23.65 61.5,25.1 62.6,25.1 63.7,24 65.9,24 LED_3_10.A 68.85,23.65 70.3,25.1 71.4,25.1 72.5,24 74.7,24 LED_2_10.A 77.65,23.65 79.1,25.1 80.2,25.1 81.3,24 83.5,24 LED_1_10.A 86.45,23.65 87.9,25.1 89,25.1 90.1,24 92.3,24 LED_0_10.A
  Bottom 0.61: LED_10_1.K LED_10_3.K LED_10_5.K LED_10_7.K LED_10_9.K 2.85,22.92 3.9,21.87 5.66,21.87 | LED_10_0.K LED_10_2.K LED_10_4.K LED_10_6.K LED_10_8.K 7.25,23.46 5.66,21.87 | 5.66,21.87 10.83,21.87 12,20.7 16.08,20.7 R11.P$1
RST
  Top 0.254: J1.5 39.04,10.44 40.95,12.35 41.9,12.35 45.71,16.16 47.93,16.16 49.2,17.43 50.47,16.16 63.09,16.16 U$2.P$2
  Top 0.305: U$1.4 49.2,17.43

### Text on the board
tPlace: Hello | My name is: | Cache Makers | Charlieplex Challenge
bPlace: Barbary Enterprises